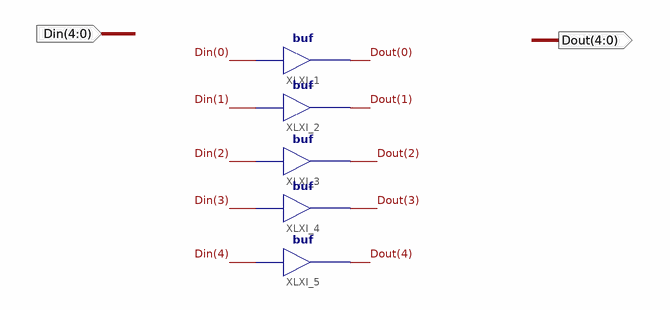
[diagram p0: schematic sheet 1]
// Xilinx ISE schematic BUF5.sch (spartan2) as structural Verilog: 5 symbols, 2 ports
module BUF5 (
  input  [4:0] Din,
  output [4:0] Dout
);

  buf XLXI_1 (Dout[0], Din[0]);
  buf XLXI_2 (Dout[1], Din[1]);
  buf XLXI_3 (Dout[2], Din[2]);
  buf XLXI_4 (Dout[3], Din[3]);
  buf XLXI_5 (Dout[4], Din[4]);
endmodule
